# Altium schematic sheet 2_BUCK.schdoc.schdoc
size 309 x 223 mm; Symbol: Sheet-Symbol_A4; Device: Sheet-Symbol_A4; @Page Name: BUCK; @Create Date: 2023-11-30; @Page Count: 13; @Page No: 2; @Project Name: STM32F722RET6; @Schematic Name: 开发板; @Update Date: 2023-12-01; Company: 嘉立创EDA; Page Size: A4; Version: V1.0
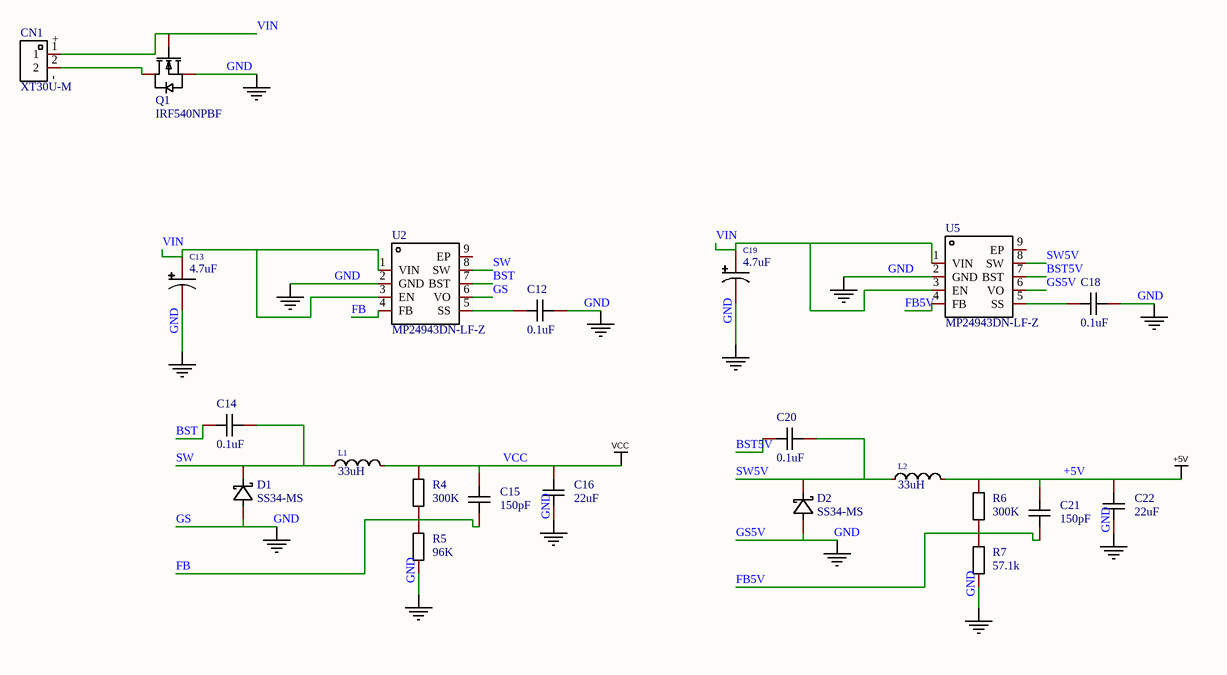
[diagram p0: 2_BUCK.schdoc.schdoc]

## Parts
C12  0.1uF  [C0603]
C13  4.7uF  [CAP-SMD_BD10.0-L10.3-W10.3-LS11.3-FD]
C14  0.1uF  [C0603]
C15  150pF  [C0603]
C16  22uF  [C0603]
C18  0.1uF  [C0603]
C19  4.7uF  [CAP-SMD_BD10.0-L10.3-W10.3-LS11.3-FD]
C20  0.1uF  [C0603]
C21  150pF  [C0603]
C22  22uF  [C0603]
CN1  XT30U-M  [CONN-TH_XT30U-M]
D1  SS34-MS  [DO-214AC_L4.3-W2.7-LS5.0-RD]
D2  SS34-MS  [DO-214AC_L4.3-W2.7-LS5.0-RD]
L1  33uH  [L0603]
L2  33uH  [L0603]
Q1  IRF540NPBF  [TO-220-3_L10.0-W4.5-P2.54-L]
R4  300K  [R0603]
R5  96K  [R0603]
R6  300K  [R0603]
R7  57.1k  [R0603]
U2  MP24943DN-LF-Z  [SOIC-8_L4.9-W3.9-P1.27-LS6.0-BL-EP]
U5  MP24943DN-LF-Z  [SOIC-8_L4.9-W3.9-P1.27-LS6.0-BL-EP]

## Nets
+5V: C21.1 C22.1 L2.2 R6.1
GND: C12.2 C13.2 C16.2 C18.2 C19.2 C22.2 D1.2(K) D2.2(K) Q1.3(S) R5.2 R7.2 U2.2(GND) U2.6(VO) U5.2(GND) U5.6(VO)  [also labelled GS, GS5V]
VCC: C15.1 C16.1 L1.2 R4.1
BST: C14.1 U2.7(BST)
BST5V: C20.1 U5.7(BST)
FB: C15.2 R4.2 R5.1 U2.4(FB)
FB5V: C21.2 R6.2 R7.1 U5.4(FB)
SW: C14.2 D1.1(A) L1.1 U2.8(SW)
SW5V: C20.2 D2.1(A) L2.1 U5.8(SW)
VIN: C13.1 C19.1 CN1.1 Q1.1(G) U2.1(VIN) U2.3(EN) U5.1(VIN) U5.3(EN)
NetC12_1: C12.1 U2.5(SS)
NetC18_1: C18.1 U5.5(SS)
NetCN1_2: CN1.2 Q1.2(D)

Not connected (* = marked no-connect by the designer): U2 9(EP); U5 9(EP)

## Notes on the sheet
- (near CN1) +
- (near CN1) -
- 1
- 2
- 3
- 4
- 5
- 6
- A
- B
- C
- 原理图
- 开发板
- 创建日期
- 更新日期
- 2023-11-30
- 2023-12-01
- 审阅
- 绘制
- 图页
- BUCK
- 物料编码
- STM32F722RET6
- D
- 版本
- 尺寸
- 页
- 共
- 13
- V1.0
- A4
- 嘉立创EDA

## Library data of the parts
C12 C14-C16 C18 C20-C22 = CAP_0603: Symbol: CapAcitance; Convert to PCB: yes; Device: CAP_0603; Add into BOM: yes; Supplier Footprint: 0603
  C12 C14 C18 C20: Name: 0.1uF; Value: 0.1uF
  C15 C21: Name: 150pF; Value: 150pF
  C16 C22: Name: 22uF; Value: 22uF
C13 C19 = UWT1H221MNL1GS: 容值:220uF;精度:±20%;额定电压:50V;纹波电流:220mA@120Hz;等效串联电阻:-;; Manufacturer: Nichicon(尼吉康); Add into BOM: yes; Tolerance: ±20%; Rated Voltage: 50V; φD: 10mm; Lifetime @ Temp: 1000hrs@105℃; Name: 4.7uF; Symbol: UWT1H221MNL1GS; Device: UWT1H221MNL1GS; LCSC Part Name: 220uF ±20% 50V; Supplier Part: C125977; Manufacturer Part: UWT1H221MNL1GS; Supplier Footprint: SMD,D10xL10mm; JLCPCB Part Class: Extended Part; Datasheet: https://atta.szlcsc.com/upload/public/pdf/source/20180326/C125982_155E7F7F009D651CD598D898348721EF.pdf; Supplier: LCSC; Convert to PCB: yes; Value: 4.7uF; L: 10mm; Ripple Current: 220mA@120Hz; Equivalent Series Resistance(ESR): -; Operating Temperature: -55℃~+105℃
CN1 = XT30U-M: 模型插头轻量版锂电池插头; Manufacturer: AMASS(艾迈斯); Add into BOM: yes; Name: XT30U-M; Symbol: XT30U-M; Device: XT30U-M; LCSC Part Name: AMASS(艾迈斯)轻量版锂电池插头公头 XT30U-M; Supplier Part: C99101; Manufacturer Part: XT30U-M; Supplier Footprint: -; JLCPCB Part Class: 扩展库; Datasheet: https://atta.szlcsc.com/upload/public/pdf/source/20170606/1496716542582.pdf; Supplier: LCSC; Convert to PCB: yes
D1 D2 = SS34-MS: 二极管配置:-;正向压降(Vf):550mV@3A;直流反向耐压(Vr):40V;平均整流电流(Io):3A;; Manufacturer: MSKSEMI(美森科); Add into BOM: yes; Reverse Voltage (Vr): 40V; Average Rectified Current (Io): 3A; Reverse Leakage Current (Ir): 500uA@40V; Name: SS34-MS; Symbol: SS34-MS; Device: SS34-MS; LCSC Part Name: 电压:40V 电流:3A; Supplier Part: C2836396; Manufacturer Part: SS34-MS; Supplier Footprint: SMA(DO-214AC); JLCPCB Part Class: 扩展库; Datasheet: https://atta.szlcsc.com/upload/public/pdf/source/20231010/B8429D209A8A83BAE11971393C9E7848.pdf; Supplier: LCSC; Convert to PCB: yes; Diode Configuration: -; Forward Voltage (Vf@If): 550mV@3A
L1 L2 = L_0603: Manufacturer: Sunlord(顺络); Symbol: SDFL1608S100KTF; Add into BOM: yes; Name: 33uH; Device: L_0603; Supplier Footprint: L0603; Convert to PCB: yes; Value: 33uH; Supplier: LCSC; Manufacturer Part: SDFL1608S100KTF; JLCPCB Part Class: Basic Part
Q1 = IRF540NPBF: 类型:N沟道;漏源电压(Vdss):100V;连续漏极电流(Id):33A;功率(Pd):130W;导通电阻(RDS(on)@Vgs,Id):44mΩ@10V,16A;; Manufacturer: Infineon(英飞凌); Add into BOM: yes; Type: N沟道; Drain Source Voltage (Vdss): 100V; Continuous Drain Current (Id): 33A; Power Dissipation (Pd): 130W; Gate Threshold Voltage (Vgs(th)@Id): 4V@250uA; Total Gate Charge (Qg@Vgs): 71nC@10V; Input Capacitance (Ciss@Vds): 1.96nF@25V; Name: IRF540NPBF; Symbol: IRF540NPBF; Device: IRF540NPBF; LCSC Part Name: N沟道 100V 33A; Supplier Part: C2566; Manufacturer Part: IRF540NPBF; Supplier Footprint: TO-220; JLCPCB Part Class: 扩展库; Datasheet: https://atta.szlcsc.com/upload/public/pdf/source/20140818/1457707225950.pdf; Supplier: LCSC; Convert to PCB: yes; Drain Source On Resistance (RDS(on)@Vgs,Id): 44mΩ@10V,16A; Operating Temperature: -55℃~+175℃@(Tj)
R4-R7 = Res_0603: Symbol: 电阻; Convert to PCB: yes; Device: Res_0603; Add into BOM: yes; Supplier Footprint: 0603
  R4 R6: Name: 300K; Value: 300K
  R5: Name: 96K; Value: 96K
  R7: Name: 57.1k; Value: 57.1k
U2 U5 = MP24943DN-LF-Z: 最大输入电压:-;可输出电流:-;; Add into BOM: yes; Name: MP24943DN-LF-Z; Symbol: MP24943DN-LF-Z; Device: MP24943DN-LF-Z; LCSC Part Name: MP24943DN-LF-Z; Supplier Part: C114133; Manufacturer Part: MP24943DN-LF-Z; Supplier Footprint: SOIC-8_EP_150mil; JLCPCB Part Class: 扩展库; Supplier: LCSC; Convert to PCB: yes